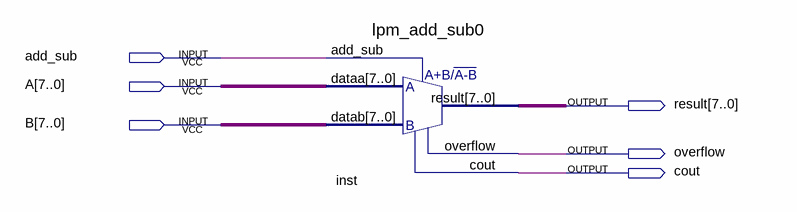
[diagram p0: schematic sheet]
// Quartus schematic add_sub.bdf as structural Verilog: 1 symbols, 6 pins
module add_sub (
  input  add_sub,
  input  [7:0] A,
  input  [7:0] B,
  output [7:0] result,
  output overflow,
  output cout
);

  lpm_add_sub0 inst (.dataa(A), .datab(B), .add_sub(add_sub), .result(result), .overflow(overflow), .cout(cout));
endmodule
